# Altium project Motor_Driver.PrjPCB
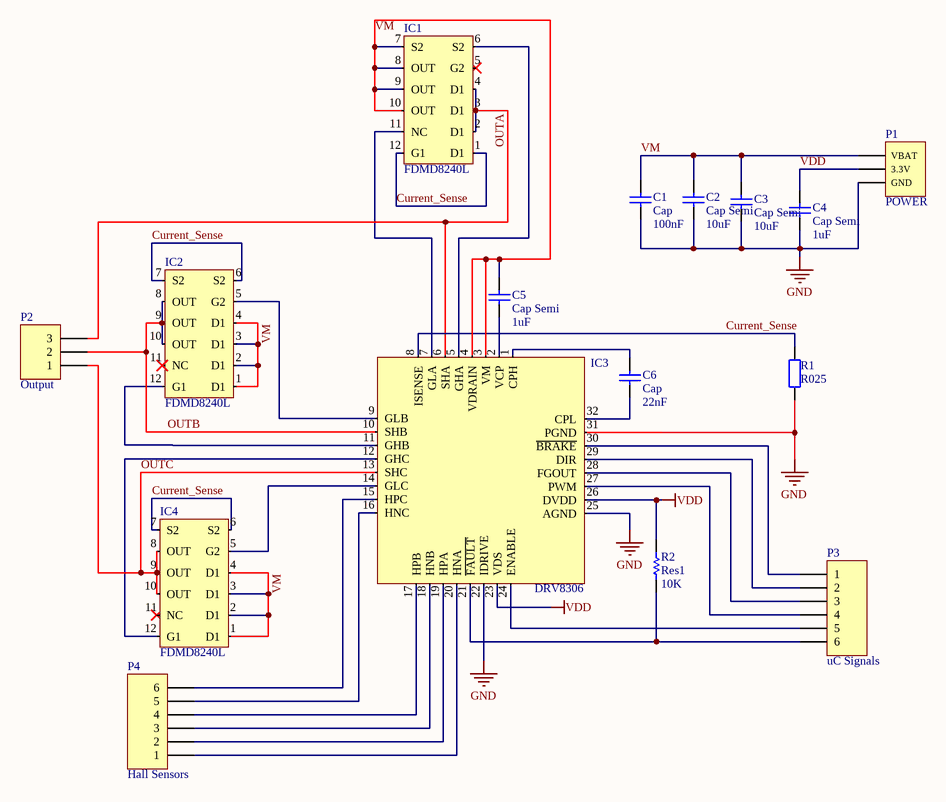
[diagram p0: Motor_Driver.SchDoc]
1 sheet, 16 parts. Net scope: global (net labels, ports and power ports of the same name join across sheets).

## Sheet Motor_Driver.SchDoc
size A4

### Parts
C1  Cap  value 100nF  [0402]
C2  Cap Semi  value 10uF  [CAP_TANT1206]
C3  Cap Semi  value 10uF  [CAP_TANT1206]
C4  Cap Semi  value 1uF  [0402]
C5  Cap Semi  value 1uF  [0402]
C6  Cap  value 22nF  [0402]
IC1  FDMD8240L  [PQFN-12]
IC2  FDMD8240L  [PQFN-12]
IC3  DRV8306
IC4  FDMD8240L  [PQFN-12]
P1  POWER  [HDR1X3]
P2  Output  [HDR1X3]
P3  uC Signals  [HDR1X6]
P4  Hall Sensors  [HDR1X6]
R1  R025  [RES2818]
R2  Res1  value 10K  [RES0402]

### Nets
GND: C1.1 C2.1 C3.1 C4.1 IC3.22(IDRIVE) IC3.25(AGND) IC3.31(PGND) P1.3(GND) R1.1
VDD: C4.2 IC3.23(VDS) IC3.26(DVDD) P1.2(3.3V) R2.2
Current_Sense: IC1.1(D1) IC1.12(G1) IC2.6(S2) IC2.7(S2) IC3.8(ISENSE) IC4.6(S2) IC4.7(S2) R1.2
OUTA: IC1.2(D1) IC1.3(D1) IC1.4(D1) IC3.6(SHA) P2.3
OUTB: IC2.8(OUT) IC2.9(OUT) IC2.10(OUT) IC3.10(SHB) P2.2
OUTC: IC3.13(SHC) IC4.8(OUT) IC4.9(OUT) IC4.10(OUT) P2.1
VM: C1.2 C2.2 C3.2 C5.2 IC1.7(S2) IC1.8(OUT) IC1.9(OUT) IC1.10(OUT) IC2.1(D1) IC2.2(D1) IC2.3(D1) IC2.4(D1) IC3.3(VM) IC3.4(VDRAIN) IC4.1(D1) IC4.2(D1) IC4.3(D1) IC4.4(D1) P1.1(VBAT)
NetC5_1: C5.1 IC3.2(VCP)
NetC6_1: C6.1 IC3.32(CPL)
NetC6_2: C6.2 IC3.1(CPH)
NetIC1_6: IC1.6(S2) IC3.5(GHA)
NetIC1_11: IC1.11(NC) IC3.7(GLA)
NetIC2_5: IC2.5(G2) IC3.9(GLB)
NetIC2_12: IC2.12(G1) IC3.11(GHB)
NetIC3_12: IC3.12(GHC) IC4.12(G1)
NetIC3_14: IC3.14(GLC) IC4.5(G2)
NetIC3_15: IC3.15(HPC) P4.6
NetIC3_16: IC3.16(HNC) P4.5
NetIC3_17: IC3.17(HPB) P4.4
NetIC3_18: IC3.18(HNB) P4.3
NetIC3_19: IC3.19(HPA) P4.2
NetIC3_20: IC3.20(HNA) P4.1
NetIC3_21: IC3.21(~{FAULT}) P3.6 R2.1
NetIC3_24: IC3.24(ENABLE) P3.5
NetIC3_27: IC3.27(PWM) P3.4
NetIC3_28: IC3.28(FGOUT) P3.3
NetIC3_29: IC3.29(DIR) P3.2
NetIC3_30: IC3.30(~{BRAKE}) P3.1

Not connected (* = marked no-connect by the designer): IC1 5(G2)*; IC2 11(NC)*; IC4 11(NC)*

### Library data of the parts
C1 = Cap: Multilayer Ceramic Capacitors MLCC - SMD/SMT 16volts 0.1uF 20% X7R; Mfr. No: C0402C104M4RACAUTO; PackageReference: SMD-0402 (1005 metric); PackageDescription: Ceramic Capacitor; Mouser No: 80-C0402C104M4RAUTO
C2 C3 = Cap Semi: Tantalum Capacitors - Solid SMD 16V 10uF 1206 10% ESR=3Ohms; Mfr. No: T491A106K016AT; PackageReference: SMD-1206(3216 metric); PackageDescription: Tantalum Capacitor; Mouser No: 80-T491A106K016
C4 C5 = Cap Semi: Multilayer Ceramic Capacitors MLCC - SMD/SMT CGB 0402 16V 1uF JB 20%; Mfr. No: CGB2A1JB1C105M033BC; PackageReference: SMD-0402(1005 metric); PackageDescription: Chip Capacitor; Mouser No: 810-CGB2A1JB1C105M0C
C6 = Cap: Capacitor; Published: 8-Jun-2000; LatestRevisionDate: 17-Jul-2002; LatestRevisionNote: Re-released for DXP Platform.; PackageReference: RAD-0.3; Publisher: Altium Limited; PackageDescription: Radial Cap, Thru-Hole; 2 Leads; 0.3 in Pin Spacing
IC1 IC2 IC4 = FDMD8240L: Dual N-Channel Power Trench MOSFET 40, 98A, 2.6mOhms; Mfr. No: FDMD8240L; Mouser No: 512-FDMD8240L
IC3 = DRV8306: DRV8306 38-V Brushless DC Motor Controller; Mfr. No: DRV8306HRSMT; Mouser No: 595-DRV8306HRSMT
P1 = Header 3: Power Connector; LatestRevisionDate: 17-Jul-2002; LatestRevisionNote: Re-released for DXP Platform.; Publisher: Altium Limited
P2 = Header 3: Motor Output; LatestRevisionDate: 17-Jul-2002; LatestRevisionNote: Re-released for DXP Platform.; Publisher: Altium Limited
P3 = Header 6: Microcontroller connector; LatestRevisionDate: 17-Jul-2002; LatestRevisionNote: Re-released for DXP Platform.; Publisher: Altium Limited
P4 = Header 6: Hall Sensors Connector; LatestRevisionDate: 17-Jul-2002; LatestRevisionNote: Re-released for DXP Platform.; Publisher: Altium Limited
R1 = WSHP2818: Current Sense Resistors - SMD2818 10W .025ohms 1%; Mfr. No: WSHP2818R0250FEA; Mouser No: 71-WSHP2818R0250FEA
R2 = Res1: Thick Film Resistors - SMD 0.2watt 10Kohms 1% 100ppm; Mfr. No: RCS040210K0FKED; PackageReference: SMD-0402(1005 metric); PackageDescription: Chip Resistor; Mouser No: 71-RCS040210K0FKED